# EasyEDA schematic SCH_Robot_2025-06-21 (1).json
TITLE: Sheet_1; REV: 1.0; Date: 2025-06-21; Sheet: 1/1; Drawn By: jjyapxd; Company: Your Company
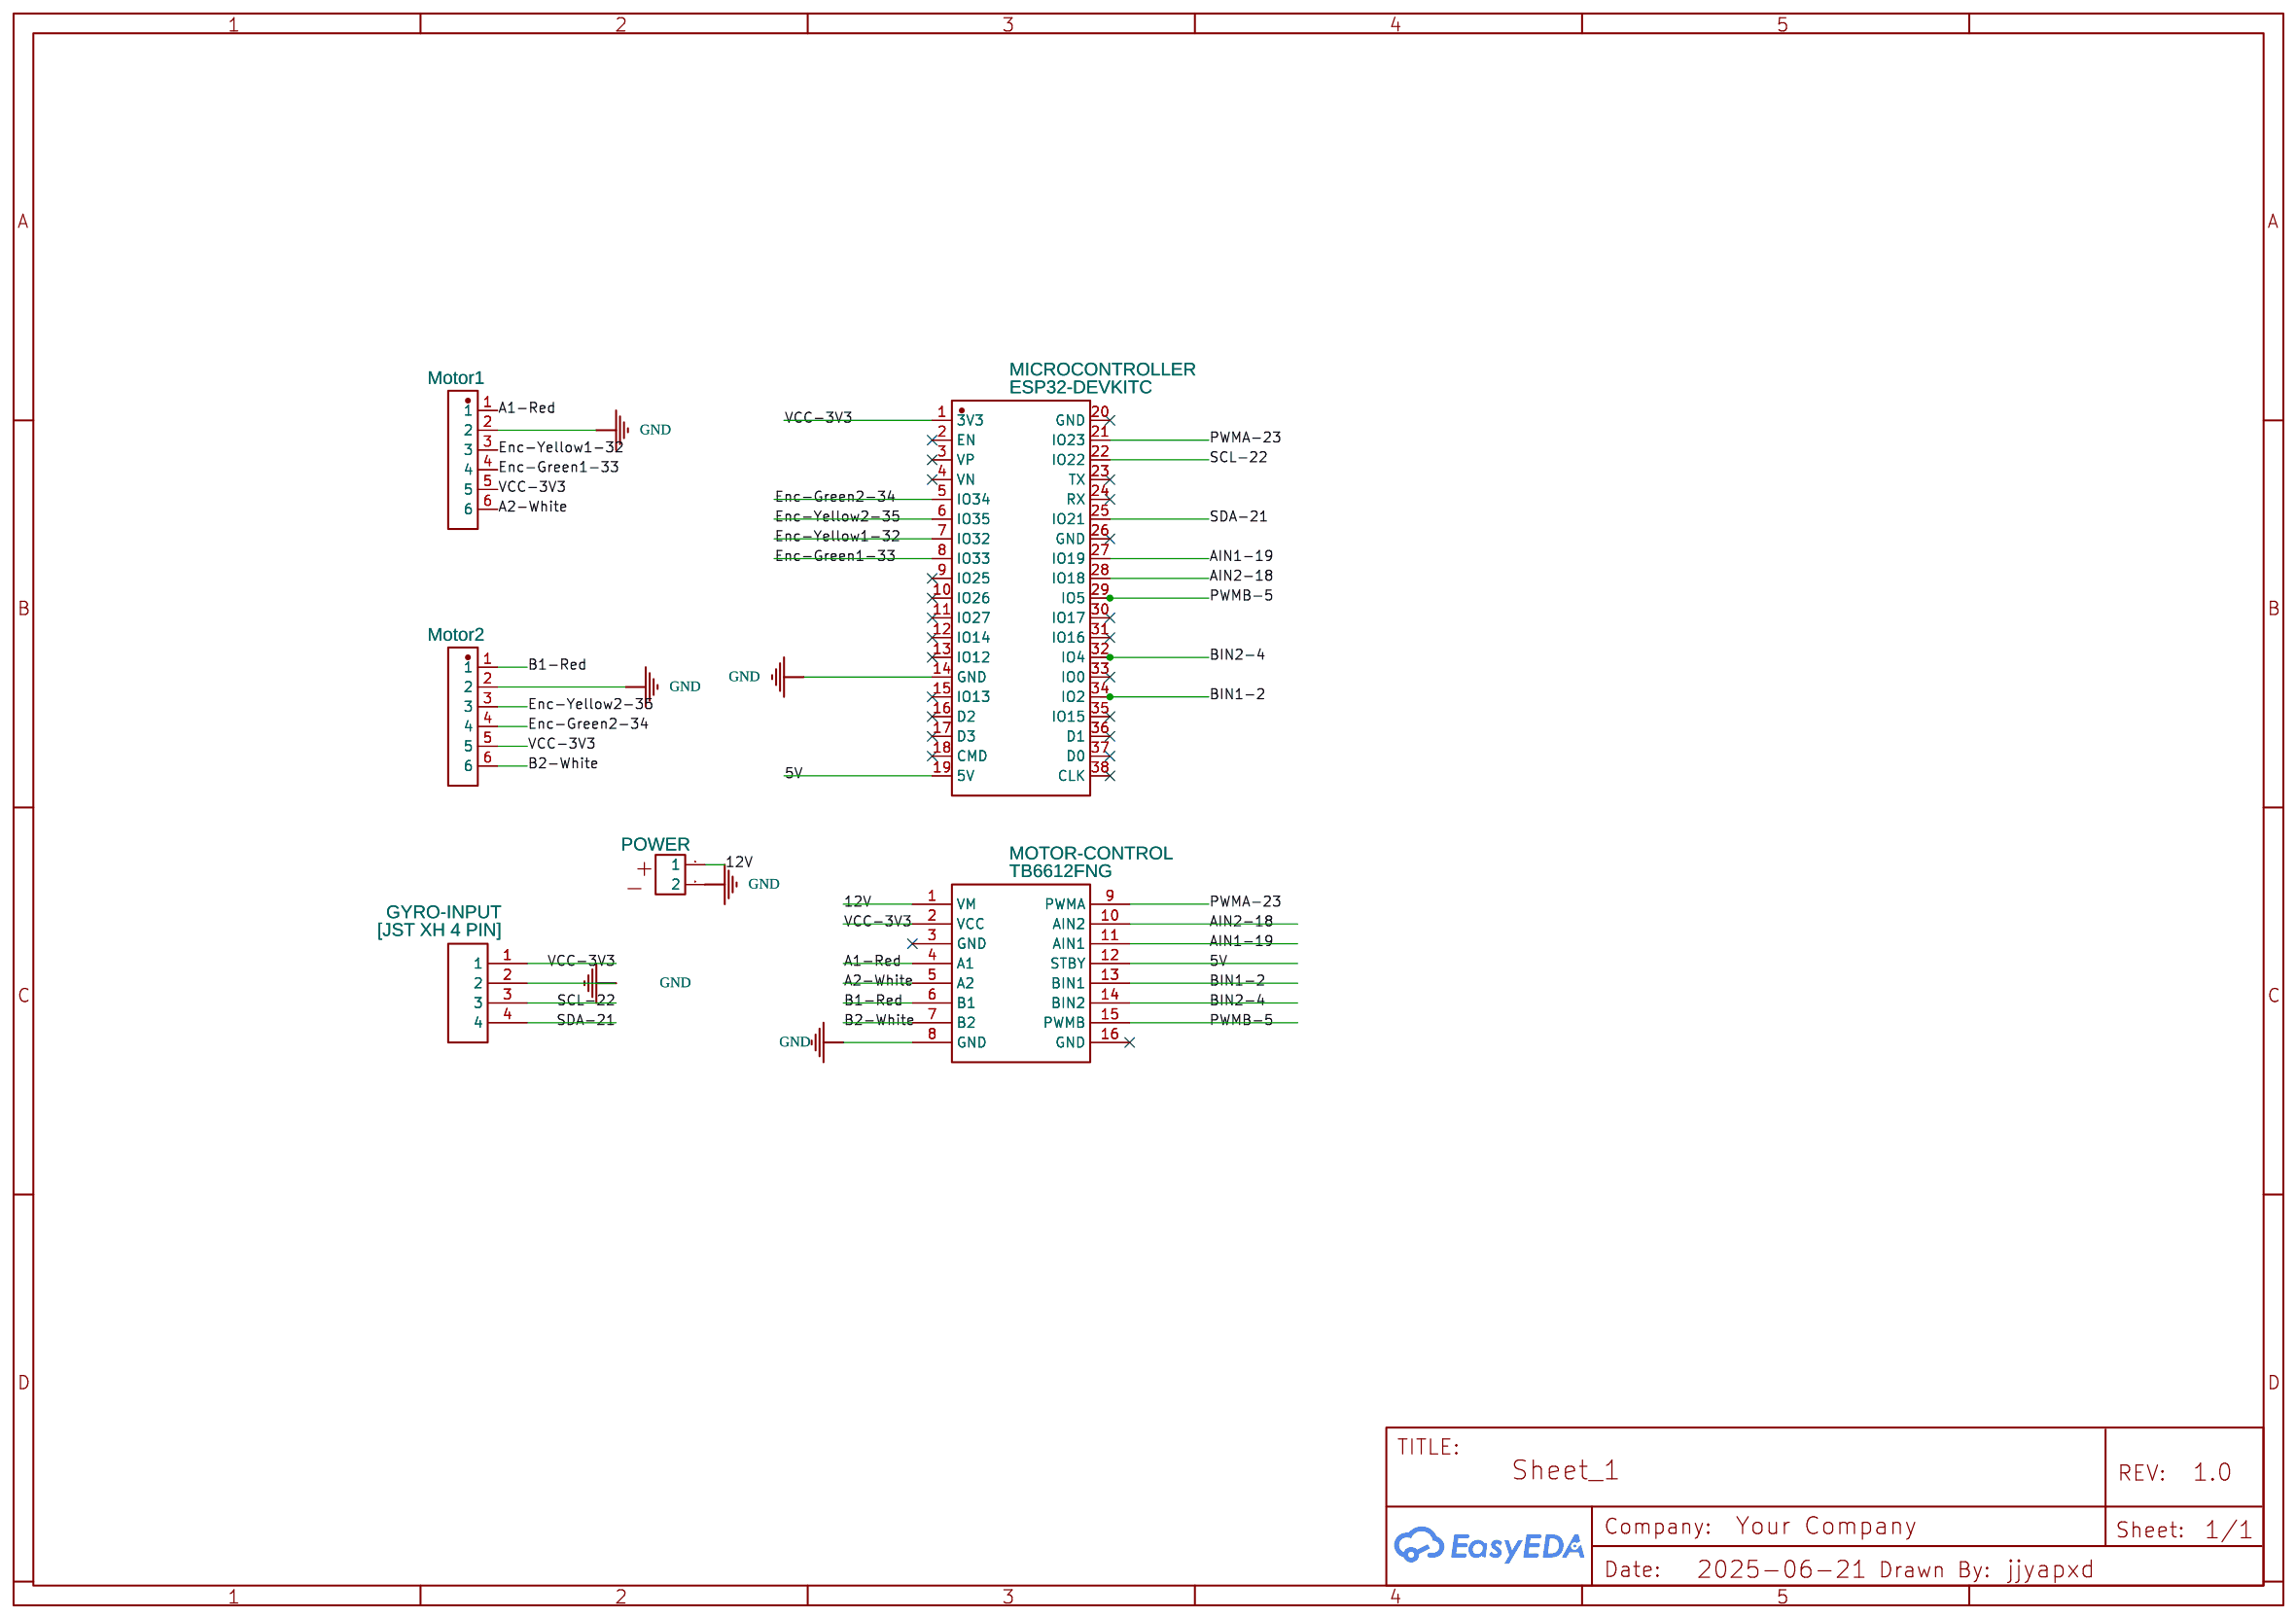
[diagram p0: schematic sheet]

## Parts
GYRO-INPUT  [JST XH 4 PIN]  [JST XH WTB-2.5P-4]
J1  Motor2  [XH2.54-6AW]
J2  Motor1  [XH2.54-6AW]
MICROCONTROLLER  ESP32-DEVKITC  [BULETM-SMD_ESP32-DEVKITC]
MOTOR-CONTROL  TB6612FNG  [TB6612FNG]
POWER  ZS-Header-F-2.54_1x2  [ZS-JST-XHP-2-PIN_CPA]

## Library data of the parts
GYRO-INPUT = [JST XH 4 PIN]: Supplier: AMAZON; link: https://www.amazon.com/gp/product/B01MCZE2HM/ref=ppx_yo_dt_b_asin_title_o09_s00?ie=UTF8&psc=1; Contributor: ontrace
J1 J2 = XH2.54-6_BAT: Contributor: Богдан Деркач
MICROCONTROLLER = ESP32-DEVKITC: Supplier: LCSC; Supplier Part: C571180; Manufacturer: ESPRESSIF(乐鑫); Manufacturer Part: ESP32-DevKitC; Contributor: lcsc; JLCPCB Part Class: Extended Part
MOTOR-CONTROL = TB6612FNG: Contributor: NonpawitE
POWER = ZS-Header-F-2.54_1x2: Supplier: Banggood; Manufacturer: Banggood; Manufacturer Part: 56156; Supplier Part: 56154; link: https://www.banggood.com/Wholesale-1-Pair-40-Pin-2_54mm-Male-Female-SIL-Header-Socket-Row-Strip-PCB-Connector-p-56154.html?rmmds=search; Contributor: carlosplazaaguilera

## Nets
5V: MICROCONTROLLER.19(5V) MOTOR-CONTROL.12(STBY)
12V: MOTOR-CONTROL.1(VM) POWER.1
GND: GYRO-INPUT.2 J1.2 J2.2 MICROCONTROLLER.14(GND) MOTOR-CONTROL.8(GND) POWER.2
VCC-3V3: GYRO-INPUT.1 J1.5 J2.5 MICROCONTROLLER.1(3V3) MOTOR-CONTROL.2(VCC)
A1-Red: J2.1 MOTOR-CONTROL.4(A1)
A2-White: J2.6 MOTOR-CONTROL.5(A2)
AIN1-19: MICROCONTROLLER.27(IO19) MOTOR-CONTROL.11(AIN1)
AIN2-18: MICROCONTROLLER.28(IO18) MOTOR-CONTROL.10(AIN2)
B1-Red: J1.1 MOTOR-CONTROL.6(B1)
B2-White: J1.6 MOTOR-CONTROL.7(B2)
BIN1-2: MICROCONTROLLER.34(IO2) MOTOR-CONTROL.13(BIN1)
BIN2-4: MICROCONTROLLER.32(IO4) MOTOR-CONTROL.14(BIN2)
Enc-Green1-33: J2.4 MICROCONTROLLER.8(IO33)
Enc-Green2-34: J1.4 MICROCONTROLLER.5(IO34)
Enc-Yellow1-32: J2.3 MICROCONTROLLER.7(IO32)
Enc-Yellow2-35: J1.3 MICROCONTROLLER.6(IO35)
PWMA-23: MICROCONTROLLER.21(IO23) MOTOR-CONTROL.9(PWMA)
PWMB-5: MICROCONTROLLER.29(IO5) MOTOR-CONTROL.15(PWMB)
SCL-22: GYRO-INPUT.3 MICROCONTROLLER.22(IO22)
SDA-21: GYRO-INPUT.4 MICROCONTROLLER.25(IO21)

Not connected (* = marked no-connect by the designer): MICROCONTROLLER 2(EN)* 3(VP)* 4(VN)* 9(IO25)* 10(IO26)* 11(IO27)* 12(IO14)* 13(IO12)* 15(IO13)* 16(D2)* 17(D3)* 18(CMD)* 20(GND)* 23(TX)* 24(RX)* 26(GND)* 30(IO17)* 31(IO16)* 33(IO0)* 35(IO15)* 36(D1)* 37(D0)* 38(CLK)*; MOTOR-CONTROL 3(GND)* 16(GND)*
